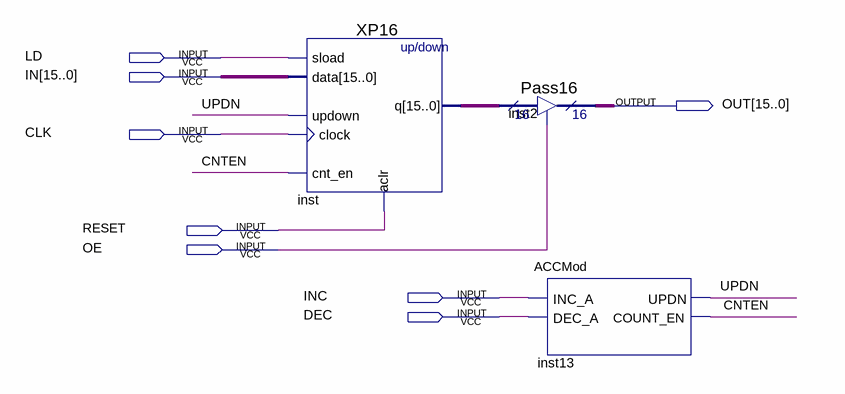
[diagram p0: schematic sheet]
// Quartus schematic XPReg.bdf as structural Verilog: 3 symbols, 8 pins
module XPReg (
  input  LD,
  input  [15:0] IN,
  input  CLK,
  input  RESET,
  input  OE,
  input  INC,
  input  DEC,
  output [15:0] OUT
);

  wire CNTEN, UPDN;
  wire [15:0] inst_q;

  XP16 inst (.sload(LD), .data(IN), .updown(UPDN), .clock(CLK), .cnt_en(CNTEN), .aclr(RESET), .q(inst_q));
  Pass16 inst2 (.enabledt(OE), .data(inst_q), .tridata(OUT));
  ACCMod inst13 (.INC_A(INC), .DEC_A(DEC), .UPDN(UPDN), .COUNT_EN(CNTEN));
endmodule
